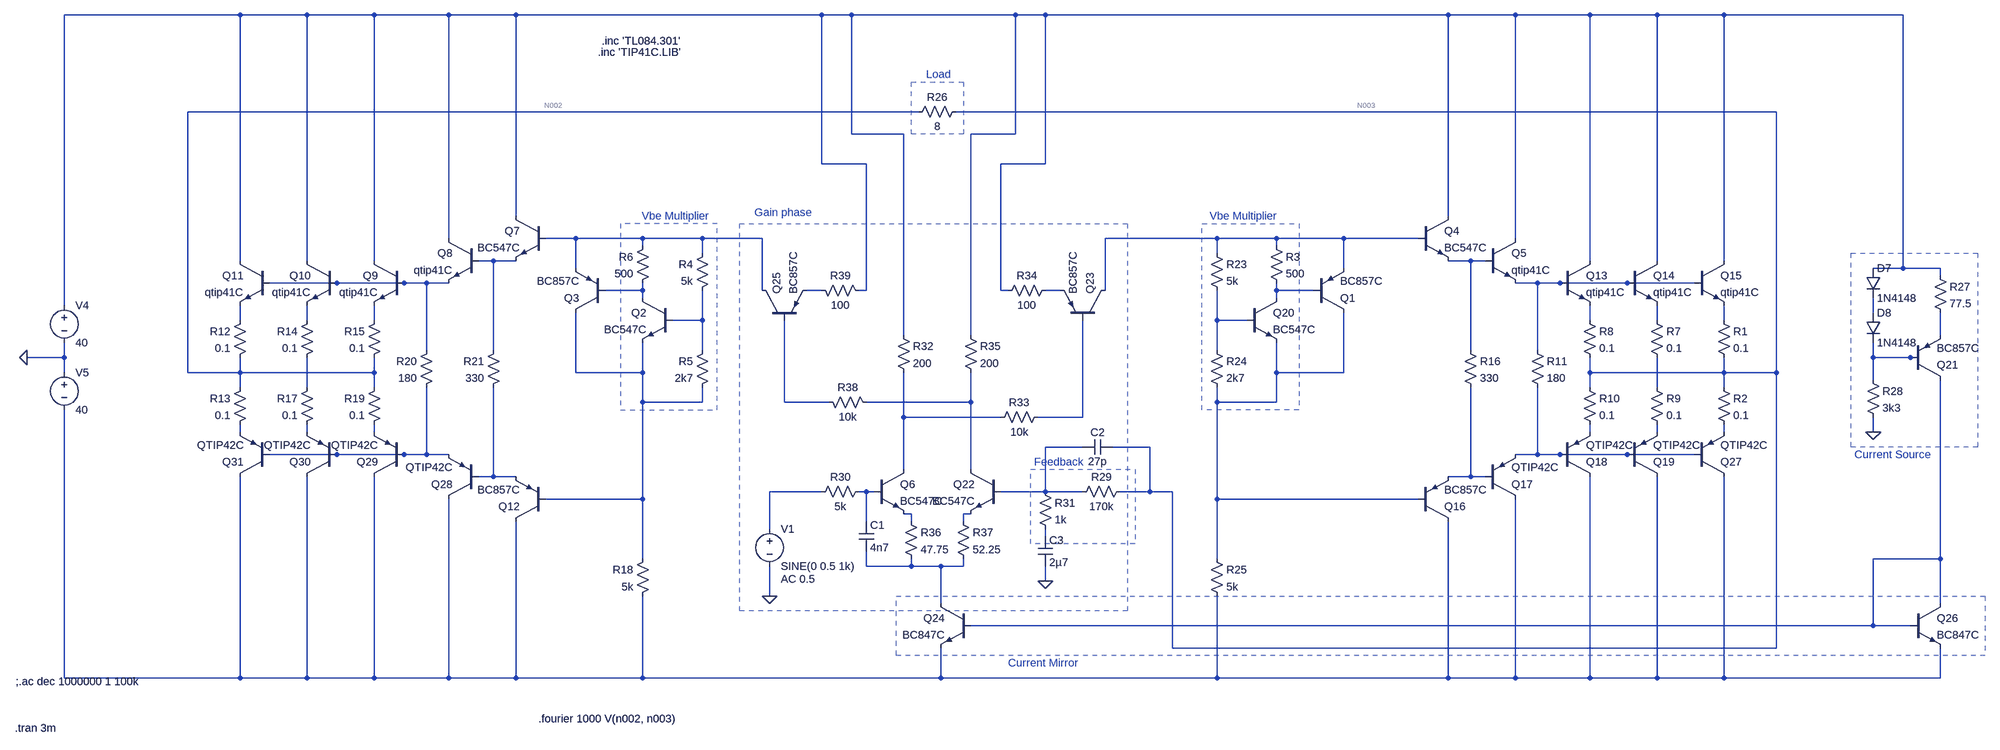
[diagram p0: schematic testV2.asc]
testV2.asc, the LTspice schematic file:
Version 4
SHEET 1 2416 748
WIRE -1344 -800 -2016 -800
WIRE -1200 -800 -1344 -800
WIRE -1056 -800 -1200 -800
WIRE -896 -800 -1056 -800
WIRE -752 -800 -896 -800
WIRE -96 -800 -752 -800
WIRE -32 -800 -96 -800
WIRE 320 -800 -32 -800
WIRE 384 -800 320 -800
WIRE 1248 -800 384 -800
WIRE 1392 -800 1248 -800
WIRE 1552 -800 1392 -800
WIRE 1696 -800 1552 -800
WIRE 1840 -800 1696 -800
WIRE 2224 -800 1840 -800
WIRE 112 -592 -1456 -592
WIRE 1952 -592 192 -592
WIRE -32 -544 -32 -800
WIRE 80 -544 -32 -544
WIRE 320 -544 320 -800
WIRE 320 -544 224 -544
WIRE -96 -480 -96 -800
WIRE 0 -480 -96 -480
WIRE 384 -480 384 -800
WIRE 384 -480 288 -480
WIRE -752 -368 -752 -800
WIRE 1248 -368 1248 -800
WIRE -896 -320 -896 -800
WIRE -624 -320 -688 -320
WIRE -480 -320 -624 -320
WIRE -352 -320 -480 -320
WIRE -224 -320 -352 -320
WIRE 752 -320 512 -320
WIRE 880 -320 752 -320
WIRE 1024 -320 880 -320
WIRE 1184 -320 1024 -320
WIRE 1392 -320 1392 -800
WIRE -480 -304 -480 -320
WIRE 880 -304 880 -320
WIRE -352 -288 -352 -320
WIRE 752 -288 752 -320
WIRE -1344 -272 -1344 -800
WIRE -1200 -272 -1200 -800
WIRE -1056 -272 -1056 -800
WIRE -800 -272 -832 -272
WIRE -752 -272 -800 -272
WIRE 1296 -272 1248 -272
WIRE 1328 -272 1296 -272
WIRE 1552 -272 1552 -800
WIRE 1696 -272 1696 -800
WIRE 1840 -272 1840 -800
WIRE -624 -256 -624 -320
WIRE 1024 -256 1024 -320
WIRE 2224 -256 2224 -800
WIRE 2224 -256 2160 -256
WIRE 2304 -256 2224 -256
WIRE 2304 -240 2304 -256
WIRE -1136 -224 -1280 -224
WIRE -992 -224 -1136 -224
WIRE -944 -224 -992 -224
WIRE -896 -224 -944 -224
WIRE 1440 -224 1392 -224
WIRE 1488 -224 1440 -224
WIRE 1632 -224 1488 -224
WIRE 1776 -224 1632 -224
WIRE -480 -208 -480 -224
WIRE -480 -208 -560 -208
WIRE -224 -208 -224 -320
WIRE -96 -208 -128 -208
WIRE 0 -208 0 -480
WIRE 0 -208 -16 -208
WIRE 288 -208 288 -480
WIRE 304 -208 288 -208
WIRE 416 -208 384 -208
WIRE 512 -208 512 -320
WIRE 880 -208 880 -224
WIRE 960 -208 880 -208
WIRE -480 -192 -480 -208
WIRE 880 -192 880 -208
WIRE -2016 -176 -2016 -800
WIRE 2160 -160 2160 -192
WIRE -1344 -144 -1344 -176
WIRE -1200 -144 -1200 -176
WIRE -1056 -144 -1056 -176
WIRE -352 -144 -352 -208
WIRE -352 -144 -416 -144
WIRE 752 -144 752 -208
WIRE 816 -144 752 -144
WIRE 1552 -144 1552 -176
WIRE 1696 -144 1696 -176
WIRE 1840 -144 1840 -176
WIRE 80 -112 80 -544
WIRE 224 -112 224 -544
WIRE 2304 -112 2304 -160
WIRE -944 -80 -944 -224
WIRE -800 -80 -800 -272
WIRE -352 -80 -352 -144
WIRE 752 -80 752 -144
WIRE 1296 -80 1296 -272
WIRE 1440 -80 1440 -224
WIRE -2016 -64 -2016 -96
WIRE -2016 -64 -2096 -64
WIRE 2160 -64 2160 -96
WIRE 2240 -64 2160 -64
WIRE 2256 -64 2240 -64
WIRE -2016 -32 -2016 -64
WIRE -1456 -32 -1456 -592
WIRE -1344 -32 -1344 -64
WIRE -1344 -32 -1456 -32
WIRE -1056 -32 -1056 -64
WIRE -1056 -32 -1344 -32
WIRE -624 -32 -624 -160
WIRE -480 -32 -480 -96
WIRE -480 -32 -624 -32
WIRE 880 -32 880 -96
WIRE 1024 -32 1024 -160
WIRE 1024 -32 880 -32
WIRE 1552 -32 1552 -64
WIRE 1840 -32 1840 -64
WIRE 1840 -32 1552 -32
WIRE 1952 -32 1952 -592
WIRE 1952 -32 1840 -32
WIRE 2160 -16 2160 -64
WIRE -1344 0 -1344 -32
WIRE -1200 0 -1200 -64
WIRE -1056 0 -1056 -32
WIRE 1552 0 1552 -32
WIRE 1696 0 1696 -64
WIRE 1840 0 1840 -32
WIRE -480 32 -480 -32
WIRE -352 32 -352 0
WIRE -352 32 -480 32
WIRE -176 32 -176 -144
WIRE -80 32 -176 32
WIRE 224 32 224 -32
WIRE 224 32 0 32
WIRE 752 32 752 0
WIRE 880 32 880 -32
WIRE 880 32 752 32
WIRE 80 64 80 -32
WIRE 288 64 80 64
WIRE 464 64 464 -144
WIRE 464 64 368 64
WIRE -1344 96 -1344 80
WIRE -1200 96 -1200 80
WIRE -1056 96 -1056 80
WIRE 1552 96 1552 80
WIRE 1696 96 1696 80
WIRE 1840 96 1840 80
WIRE 2160 96 2160 64
WIRE 464 128 384 128
WIRE 608 128 528 128
WIRE -1136 144 -1280 144
WIRE -992 144 -1136 144
WIRE -944 144 -944 0
WIRE -944 144 -992 144
WIRE -896 144 -944 144
WIRE 1440 144 1440 0
WIRE 1440 144 1392 144
WIRE 1488 144 1440 144
WIRE 1632 144 1488 144
WIRE 1776 144 1632 144
WIRE 80 176 80 64
WIRE 224 176 224 32
WIRE -800 192 -800 0
WIRE -800 192 -832 192
WIRE -752 192 -800 192
WIRE 1296 192 1296 0
WIRE 1296 192 1248 192
WIRE 1328 192 1296 192
WIRE -96 224 -208 224
WIRE 0 224 -16 224
WIRE 16 224 0 224
WIRE 384 224 384 128
WIRE 384 224 288 224
WIRE 464 224 384 224
WIRE 608 224 608 128
WIRE 608 224 544 224
WIRE 656 224 608 224
WIRE -480 240 -480 32
WIRE -480 240 -688 240
WIRE 752 240 752 32
WIRE 1184 240 752 240
WIRE 96 272 80 272
WIRE 224 272 208 272
WIRE 0 288 0 224
WIRE 96 288 96 272
WIRE 208 288 208 272
WIRE -208 304 -208 224
WIRE 384 320 384 304
WIRE -480 368 -480 240
WIRE 752 368 752 240
WIRE 2304 368 2304 -16
WIRE 2304 368 2160 368
WIRE 0 384 0 352
WIRE 96 384 96 368
WIRE 96 384 0 384
WIRE 160 384 96 384
WIRE 208 384 208 368
WIRE 208 384 160 384
WIRE 384 416 384 384
WIRE -208 448 -208 384
WIRE 160 464 160 384
WIRE 2304 464 2304 368
WIRE 2160 512 2160 368
WIRE 2160 512 224 512
WIRE 2240 512 2160 512
WIRE 656 560 656 224
WIRE 1952 560 1952 -32
WIRE 1952 560 656 560
WIRE -2016 624 -2016 48
WIRE -1344 624 -1344 192
WIRE -1344 624 -2016 624
WIRE -1200 624 -1200 192
WIRE -1200 624 -1344 624
WIRE -1056 624 -1056 192
WIRE -1056 624 -1200 624
WIRE -896 624 -896 240
WIRE -896 624 -1056 624
WIRE -752 624 -752 288
WIRE -752 624 -896 624
WIRE -480 624 -480 448
WIRE -480 624 -752 624
WIRE 160 624 160 560
WIRE 160 624 -480 624
WIRE 752 624 752 448
WIRE 752 624 160 624
WIRE 1248 624 1248 288
WIRE 1248 624 752 624
WIRE 1392 624 1392 240
WIRE 1392 624 1248 624
WIRE 1552 624 1552 192
WIRE 1552 624 1392 624
WIRE 1696 624 1696 192
WIRE 1696 624 1552 624
WIRE 1840 624 1840 192
WIRE 1840 624 1696 624
WIRE 2304 624 2304 560
WIRE 2304 624 1840 624
FLAG 2160 96 0
FLAG -2096 -64 0
FLAG -208 448 0
FLAG 384 416 0
SYMBOL res -464 352 M0
SYMATTR InstName R18
SYMATTR Value 5k
SYMBOL npn 816 -192 R0
SYMATTR InstName Q20
SYMATTR Value BC547C
SYMBOL res 736 -304 R0
SYMATTR InstName R23
SYMATTR Value 5k
SYMBOL res 736 -96 R0
SYMATTR InstName R24
SYMATTR Value 2k7
SYMBOL res 736 352 R0
SYMATTR InstName R25
SYMATTR Value 5k
SYMBOL res 208 -608 R90
WINDOW 0 0 56 VBottom 2
WINDOW 3 32 56 VTop 2
SYMATTR InstName R26
SYMATTR Value 8
SYMBOL pnp 2240 -16 M180
SYMATTR InstName Q21
SYMATTR Value BC857C
SYMBOL res 2288 -256 R0
SYMATTR InstName R27
SYMATTR Value 77.5
SYMBOL res 2144 -32 R0
SYMATTR InstName R28
SYMATTR Value 3k3
SYMBOL diode 2144 -256 R0
SYMATTR InstName D7
SYMATTR Value 1N4148
SYMBOL diode 2144 -160 R0
SYMATTR InstName D8
SYMATTR Value 1N4148
SYMBOL voltage -2016 -192 R0
WINDOW 123 0 0 Left 0
WINDOW 39 24 44 Left 2
SYMATTR InstName V4
SYMATTR Value 40
SYMBOL voltage -2016 -48 R0
WINDOW 123 0 0 Left 0
WINDOW 39 24 124 Left 2
SYMATTR InstName V5
SYMATTR Value 40
SYMBOL npn 16 176 R0
SYMATTR InstName Q6
SYMATTR Value BC547C
SYMBOL npn 288 176 M0
SYMATTR InstName Q22
SYMATTR Value BC547C
SYMBOL res 560 208 R90
WINDOW 0 0 56 VBottom 2
WINDOW 3 32 56 VTop 2
SYMATTR InstName R29
SYMATTR Value 170k
SYMBOL res 0 208 R90
WINDOW 0 0 56 VBottom 2
WINDOW 3 32 56 VTop 2
SYMATTR InstName R30
SYMATTR Value 5k
SYMBOL res 368 208 R0
SYMATTR InstName R31
SYMATTR Value 1k
SYMBOL res 64 -128 R0
SYMATTR InstName R32
SYMATTR Value 200
SYMBOL pnp 512 -144 M270
SYMATTR InstName Q23
SYMATTR Value BC857C
SYMBOL res 384 48 R90
WINDOW 0 0 56 VBottom 2
WINDOW 3 32 56 VTop 2
SYMATTR InstName R33
SYMATTR Value 10k
SYMBOL res 288 -192 R270
WINDOW 0 32 56 VTop 2
WINDOW 3 0 56 VBottom 2
SYMATTR InstName R34
SYMATTR Value 100
SYMBOL npn 224 464 M0
SYMATTR InstName Q24
SYMATTR Value BC847C
SYMBOL res 208 -128 R0
SYMATTR InstName R35
SYMATTR Value 200
SYMBOL res 80 272 R0
SYMATTR InstName R36
SYMATTR Value 47.75
SYMBOL res 192 272 R0
SYMATTR InstName R37
SYMATTR Value 52.25
SYMBOL voltage -208 288 R0
WINDOW 123 24 124 Left 2
WINDOW 39 0 0 Left 0
SYMATTR Value2 AC 0.5
SYMATTR InstName V1
SYMATTR Value SINE(0 0.5 1k)
SYMBOL pnp -224 -144 R270
SYMATTR InstName Q25
SYMATTR Value BC857C
SYMBOL res -96 16 M90
WINDOW 0 0 56 VBottom 2
WINDOW 3 32 56 VTop 2
SYMATTR InstName R38
SYMATTR Value 10k
SYMBOL res 0 -192 M270
WINDOW 0 32 56 VTop 2
WINDOW 3 0 56 VBottom 2
SYMATTR InstName R39
SYMATTR Value 100
SYMBOL npn 2240 464 R0
SYMATTR InstName Q26
SYMATTR Value BC847C
SYMBOL cap -16 288 R0
SYMATTR InstName C1
SYMATTR Value 4n7
SYMBOL cap 528 112 R90
WINDOW 0 0 32 VBottom 2
WINDOW 3 32 32 VTop 2
SYMATTR InstName C2
SYMATTR Value 27p
SYMBOL cap 368 320 R0
SYMATTR InstName C3
SYMATTR Value 2µ7
SYMBOL res 864 -320 R0
SYMATTR InstName R3
SYMATTR Value 500
SYMBOL pnp 960 -160 M180
SYMATTR InstName Q1
SYMATTR Value BC857C
SYMBOL npn -416 -192 M0
SYMATTR InstName Q2
SYMATTR Value BC547C
SYMBOL res -336 -304 M0
SYMATTR InstName R4
SYMATTR Value 5k
SYMBOL res -336 -96 M0
SYMATTR InstName R5
SYMATTR Value 2k7
SYMBOL res -464 -320 M0
SYMATTR InstName R6
SYMATTR Value 500
SYMBOL pnp -560 -160 R180
SYMATTR InstName Q3
SYMATTR Value BC857C
SYMBOL npn 1184 -368 R0
SYMATTR InstName Q4
SYMATTR Value BC547C
SYMBOL npn 1328 -320 R0
SYMATTR InstName Q5
SYMATTR Value qtip41C
SYMBOL npn 1488 -272 R0
SYMATTR InstName Q13
SYMATTR Value qtip41C
SYMBOL npn 1632 -272 R0
SYMATTR InstName Q14
SYMATTR Value qtip41C
SYMBOL npn 1776 -272 R0
SYMATTR InstName Q15
SYMATTR Value qtip41C
SYMBOL pnp 1184 288 M180
SYMATTR InstName Q16
SYMATTR Value BC857C
SYMBOL pnp 1328 240 M180
SYMATTR InstName Q17
SYMATTR Value QTIP42C
SYMBOL pnp 1488 192 M180
SYMATTR InstName Q18
SYMATTR Value QTIP42C
SYMBOL pnp 1632 192 M180
SYMATTR InstName Q19
SYMATTR Value QTIP42C
SYMBOL pnp 1776 192 M180
SYMATTR InstName Q27
SYMATTR Value QTIP42C
SYMBOL res 1824 -160 R0
SYMATTR InstName R1
SYMATTR Value 0.1
SYMBOL res 1824 -16 R0
SYMATTR InstName R2
SYMATTR Value 0.1
SYMBOL res 1680 -160 R0
SYMATTR InstName R7
SYMATTR Value 0.1
SYMBOL res 1536 -160 R0
SYMATTR InstName R8
SYMATTR Value 0.1
SYMBOL res 1680 -16 R0
SYMATTR InstName R9
SYMATTR Value 0.1
SYMBOL res 1536 -16 R0
SYMATTR InstName R10
SYMATTR Value 0.1
SYMBOL res 1424 -96 R0
SYMATTR InstName R11
SYMATTR Value 180
SYMBOL res 1280 -96 R0
SYMATTR InstName R16
SYMATTR Value 330
SYMBOL npn -688 -368 M0
SYMATTR InstName Q7
SYMATTR Value BC547C
SYMBOL npn -832 -320 M0
SYMATTR InstName Q8
SYMATTR Value qtip41C
SYMBOL npn -992 -272 M0
SYMATTR InstName Q9
SYMATTR Value qtip41C
SYMBOL npn -1136 -272 M0
SYMATTR InstName Q10
SYMATTR Value qtip41C
SYMBOL npn -1280 -272 M0
SYMATTR InstName Q11
SYMATTR Value qtip41C
SYMBOL pnp -688 288 R180
SYMATTR InstName Q12
SYMATTR Value BC857C
SYMBOL pnp -832 240 R180
SYMATTR InstName Q28
SYMATTR Value QTIP42C
SYMBOL pnp -992 192 R180
SYMATTR InstName Q29
SYMATTR Value QTIP42C
SYMBOL pnp -1136 192 R180
SYMATTR InstName Q30
SYMATTR Value QTIP42C
SYMBOL pnp -1280 192 R180
SYMATTR InstName Q31
SYMATTR Value QTIP42C
SYMBOL res -1328 -160 M0
SYMATTR InstName R12
SYMATTR Value 0.1
SYMBOL res -1328 -16 M0
SYMATTR InstName R13
SYMATTR Value 0.1
SYMBOL res -1184 -160 M0
SYMATTR InstName R14
SYMATTR Value 0.1
SYMBOL res -1040 -160 M0
SYMATTR InstName R15
SYMATTR Value 0.1
SYMBOL res -1184 -16 M0
SYMATTR InstName R17
SYMATTR Value 0.1
SYMBOL res -1040 -16 M0
SYMATTR InstName R19
SYMATTR Value 0.1
SYMBOL res -928 -96 M0
SYMATTR InstName R20
SYMATTR Value 180
SYMBOL res -784 -96 M0
SYMATTR InstName R21
SYMATTR Value 330
TEXT 736 -368 Left 2 ;Vbe Multiplier
TEXT 128 -672 Left 2 ;Load
TEXT -568 -744 Left 2 !.inc 'TL084.301'
TEXT 304 592 Left 2 ;Current Mirror
TEXT 2120 144 Left 2 ;Current Source
TEXT -240 -376 Left 2 ;Gain phase
TEXT 360 160 Left 2 ;Feedback
TEXT -576 -720 Left 2 !.inc 'TIP41C.LIB'
TEXT -2120 632 Left 2 !;.ac dec 1000000 1 100k
TEXT -704 712 Left 2 !.fourier 1000 V(n002, n003)
TEXT -2122 732 Left 2 !.tran 3m
TEXT -336 -368 Right 2 ;Vbe Multiplier
RECTANGLE Normal 208 -544 96 -656 2
RECTANGLE Normal 928 48 720 -352 2
RECTANGLE Normal 2400 576 64 448 2
RECTANGLE Normal 2384 128 2112 -288 2
RECTANGLE Normal 560 480 -272 -352 2
RECTANGLE Normal 576 336 352 176 2
RECTANGLE Normal -528 48 -320 -352 2

The netlist it stands for:
* testV2.asc
R18 N025 N051 5k
Q20 N013 N019 N026 0 BC547C
R23 N005 N019 5k
R24 N019 N026 2k7
R25 N026 N051 5k
R26 N003 N002 8
Q21 N049 N024 N023 0 BC857C
R27 N001 N023 77.5
R28 N024 0 3k3
D7 N001 N014 1N4148
D8 N014 N024 1N4148
V4 N001 0 40
V5 0 N051 40
Q6 N031 N045 N046 0 BC547C
Q22 N030 N039 N047 0 BC547C
R29 N003 N039 170k
R30 N045 N044 5k
R31 N039 N048 1k
R32 N001 N031 200
Q23 N005 N032 N012 0 BC857C
R33 N032 N031 10k
R34 N001 N012 100
Q24 N050 N049 N051 0 BC847C
R35 N001 N030 200
R36 N046 N050 47.75
R37 N047 N050 52.25
V1 N044 0 SINE(0 0.5 1k) AC 0.5
Q25 N004 N029 N011 0 BC857C
R38 N029 N030 10k
R39 N001 N011 100
Q26 N049 N049 N051 0 BC847C
C1 N045 N050 4n7
C2 N003 N039 27p
C3 N048 0 2µ7
R3 N005 N013 500
Q1 N026 N013 N005 0 BC857C
Q2 N010 N018 N025 0 BC547C
R4 N004 N018 5k
R5 N018 N025 2k7
R6 N004 N010 500
Q3 N025 N010 N004 0 BC857C
Q4 N001 N005 N007 0 BC547C
Q5 N001 N007 N009 0 qtip41C
Q13 N001 N009 N020 0 qtip41C
Q14 N001 N009 N021 0 qtip41C
Q15 N001 N009 N022 0 qtip41C
Q16 N051 N026 N043 0 BC857C
Q17 N051 N043 N041 0 QTIP42C
Q18 N051 N041 N036 0 QTIP42C
Q19 N051 N041 N037 0 QTIP42C
Q27 N051 N041 N038 0 QTIP42C
R1 N022 N003 0.1
R2 N003 N038 0.1
R7 N021 N028 0.1
R8 N020 N003 0.1
R9 N028 N037 0.1
R10 N003 N036 0.1
R11 N009 N041 180
R16 N007 N043 330
Q7 N001 N004 N006 0 BC547C
Q8 N001 N006 N008 0 qtip41C
Q9 N001 N008 N017 0 qtip41C
Q10 N001 N008 N016 0 qtip41C
Q11 N001 N008 N015 0 qtip41C
Q12 N051 N025 N042 0 BC857C
Q28 N051 N042 N040 0 QTIP42C
Q29 N051 N040 N035 0 QTIP42C
Q30 N051 N040 N034 0 QTIP42C
Q31 N051 N040 N033 0 QTIP42C
R12 N015 N002 0.1
R13 N002 N033 0.1
R14 N016 N027 0.1
R15 N017 N002 0.1
R17 N027 N034 0.1
R19 N002 N035 0.1
R20 N008 N040 180
R21 N006 N042 330
.model D D
.lib standard.dio
.model NPN NPN
.model PNP PNP
.lib standard.bjt
* Vbe Multiplier
* Load
.inc 'TL084.301'
* Current Mirror
* Current Source
* Gain phase
* Feedback
.inc 'TIP41C.LIB'
;.ac dec 1000000 1 100k
.fourier 1000 V(n002, n003)
.tran 3m
* Vbe Multiplier
.backanno
.end